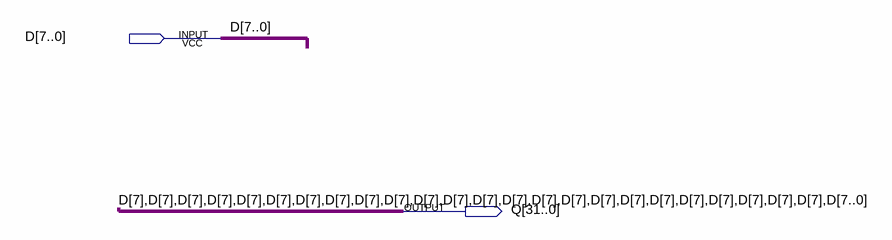
[diagram p0: schematic sheet]
// Quartus schematic ExtU8.bdf as structural Verilog: 0 symbols, 2 pins
module ExtU8 (
  input  [7:0] D,
  output [31:0] Q
);


  assign Q = {{25{D[7]}}, D[6:0]};
endmodule
